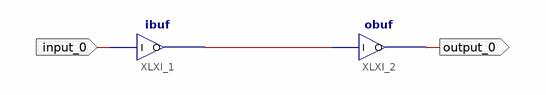
[diagram p0: schematic sheet 1]
// Xilinx ISE schematic T1.sch (spartan3) as structural Verilog: 2 symbols, 2 ports
module T1 (
  input  input_0,
  output output_0
);

  wire XLXN_1;

  ibuf XLXI_1 (.I(input_0), .O(XLXN_1));
  obuf XLXI_2 (.I(XLXN_1), .O(output_0));
endmodule
